# EasyEDA schematic ControlMoteur_ESP32.json
TITLE: Sheet_1; REV: 1.0; Date: 2021-05-30; Sheet: 1/1; Company: Your Company
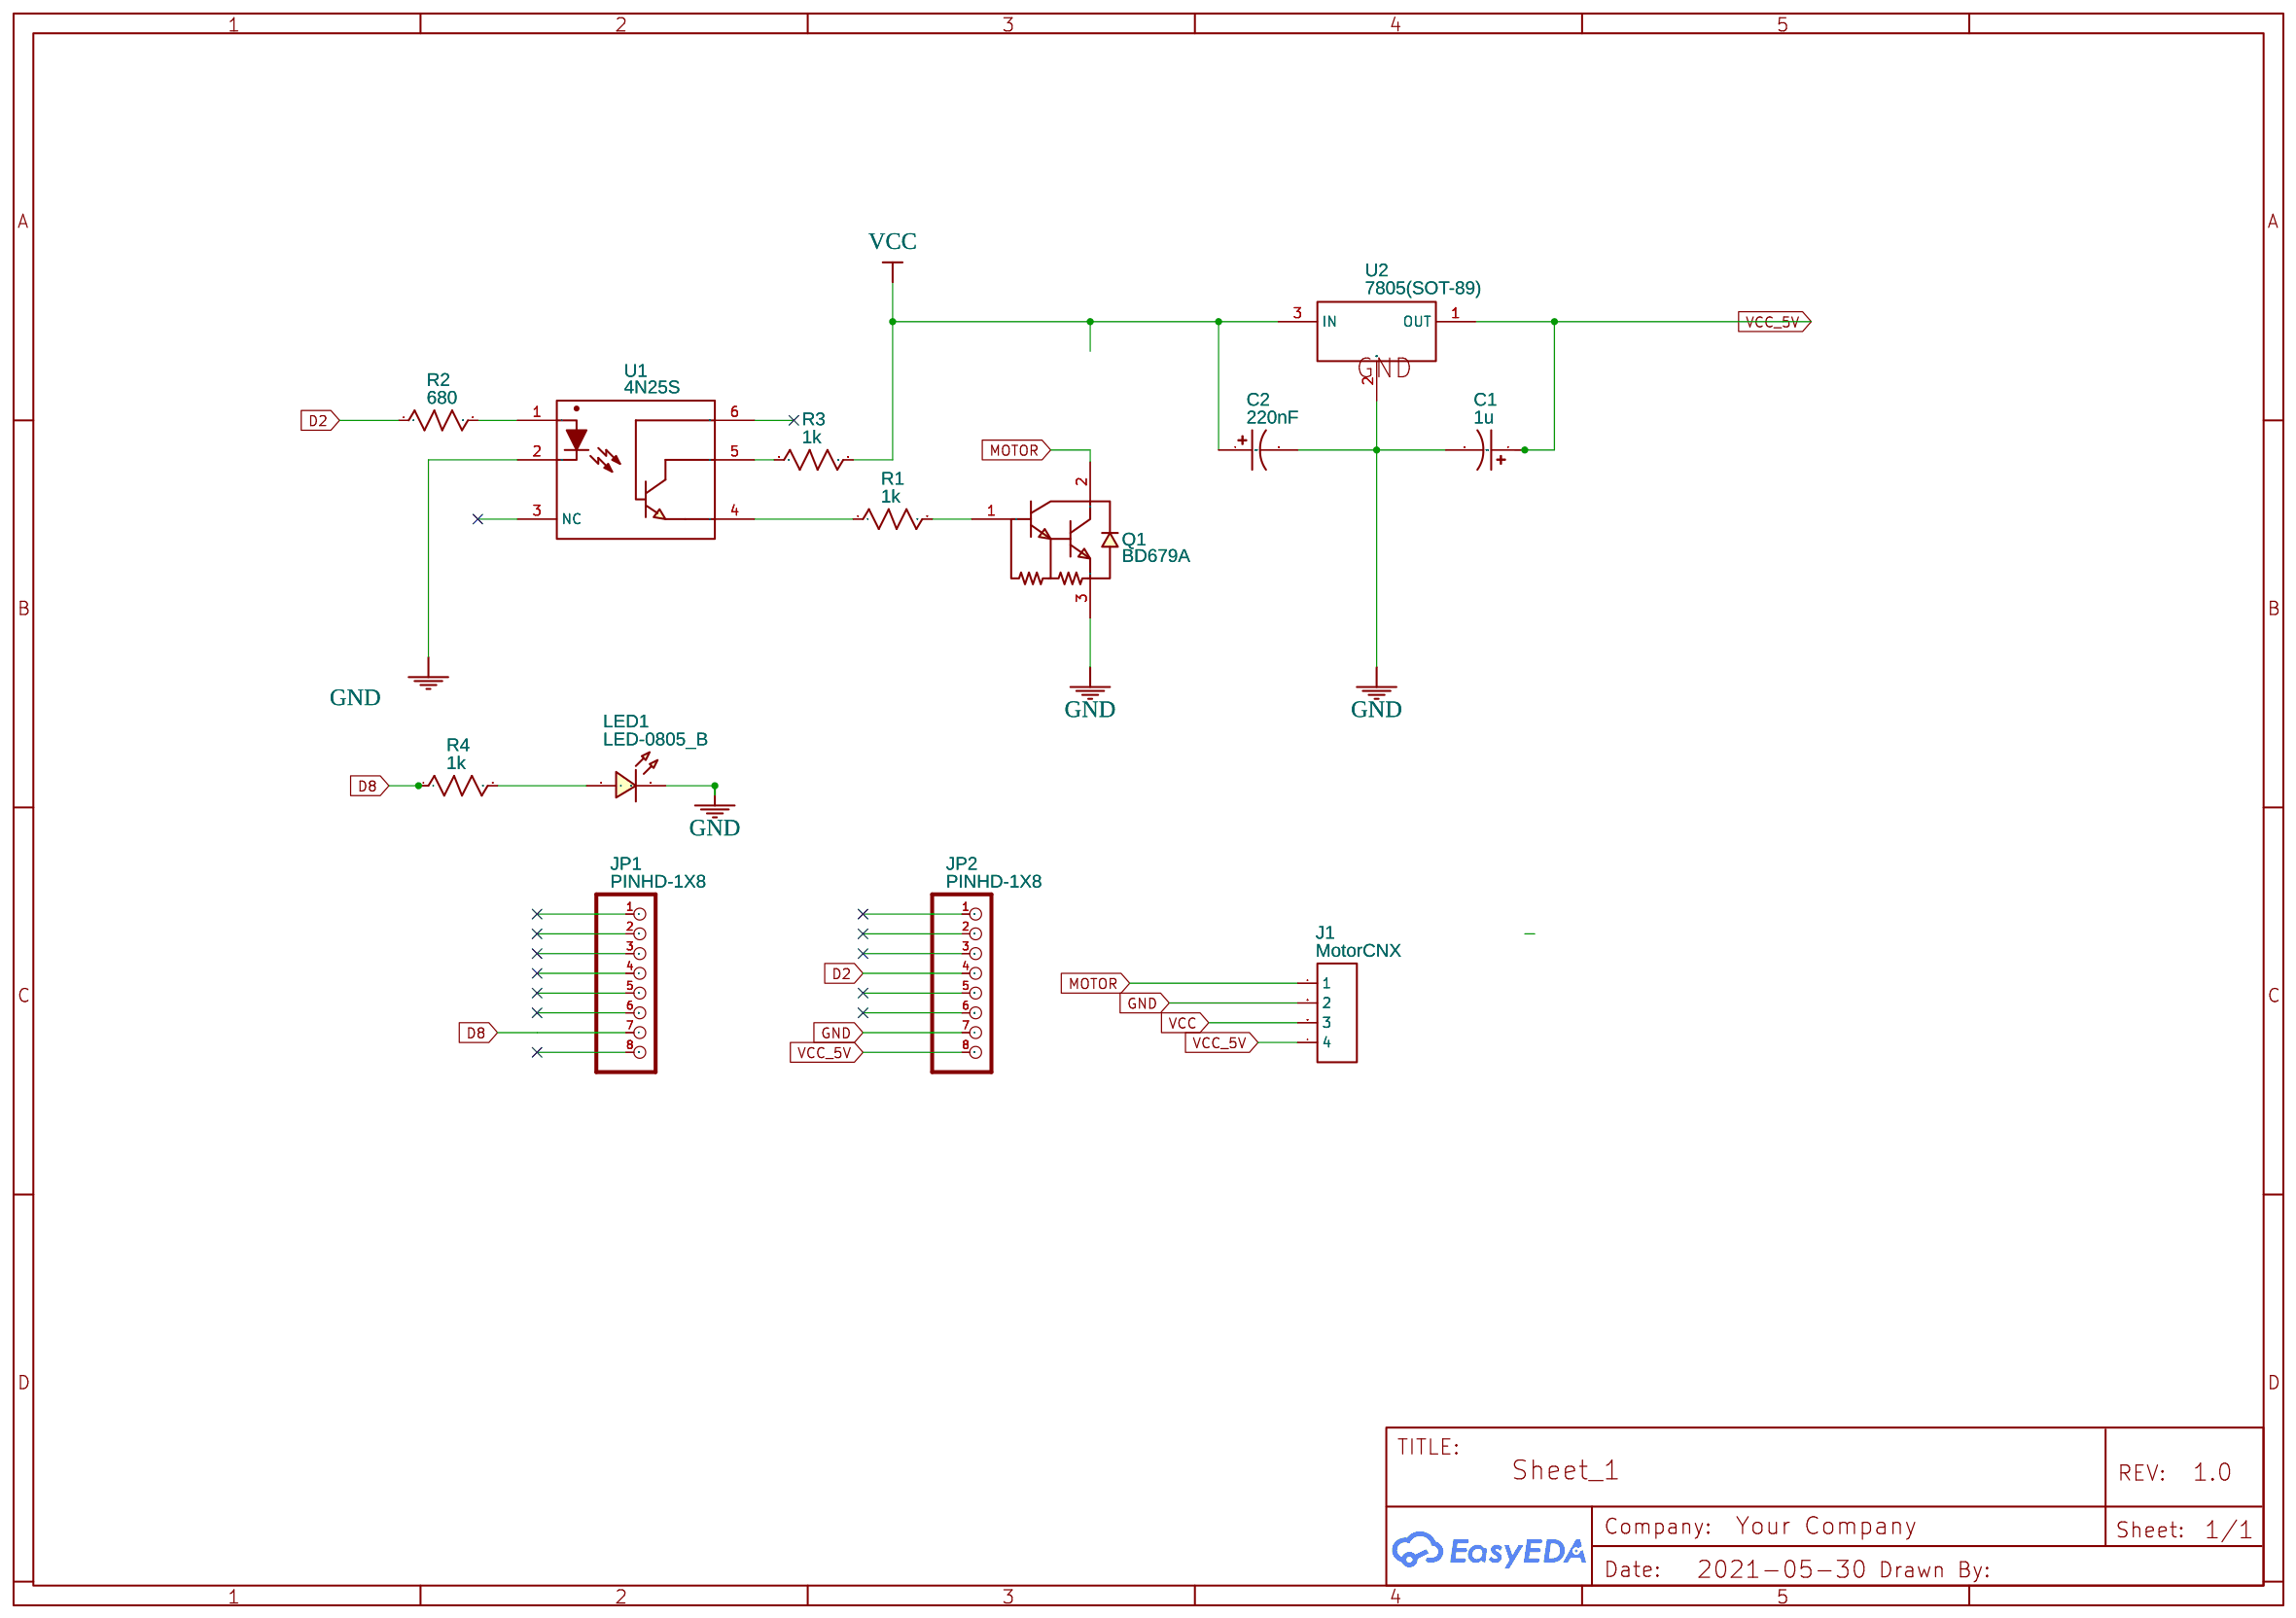
[diagram p0: schematic sheet]

## Parts
C1  1u  [CASE-A_3216]
C2  220nF  [CASE-A_3216]
J1  MotorCNX  [HDR-M-2.54_1X4]
JP1  PINHD-1X8  [1X08-LOCK]
JP2  PINHD-1X8  [1X08-LOCK]
LED1  LED-0805_B  [LED0805_BLUE]
Q1  BD679A  [SOT-32_L7.6-W2.7-P2.29-R]
R1  1k  [R1210]
R2  680  [R1210]
R3  1k  [R1210]
R4  1k  [R1210]
U1  4N25S  [OPTO-SMD-6_L8.5-W6.5-P2.54-LS9.2-BL]
U2  7805(SOT-89)  [SOT-89-3_L4.5-W2.5-P1.50-LS4.2-BR]

## Library data of the parts
C1 C2 = C_Tan_SMD_A_US: Contributor: LCEDA_Lib
J1 = HDR-M-2.54_1x4: Supplier Part: C124378; Supplier: LCSC; Contributor: LCEDA_Lib
JP1 JP2 = PINHD-1X8: Contributor: Adafruit; Package Display: No; Supplier Part: C492407
LED1 = LED-0805_B: Manufacturer: 方舟 ARKLED; Manufacturer Part: D-B080508B1-KS2; Supplier Part: C108412; Contributor: LCEDA_Lib
Q1 = BD679A: Supplier: LCSC; Supplier Part: C2760771; Manufacturer: ST(意法半导体); Contributor: LCSC; JLCPCB Part Class: Extended Part
R1-R4 = R_1210_US: Contributor: LCEDA_Lib
U1 = 4N25S: Supplier: LCSC; Manufacturer: LITEON; Contributor: LCSC; Supplier Part: C143074; JLCPCB Part Class: Extended Part
U2 = 7805(SOT-89): Supplier: LCSC; Manufacturer: CJ; Manufacturer Part: CJ78L05; image: //image.lceda.cn/szlcsc/C2079.jpg; Supplier Part: C2079; Paste Type: expand; Contributor: LCEDA_Lib

## Nets
GND: C1.2 C2.2 J1.2 JP2.7 LED1.2 Q1.3(E) U1.2(CAT) U2.2(GND)
VCC: C2.1 J1.3 R3.2 U2.3(IN)
VCC_5V: C1.1 J1.4 JP2.8 U2.1(OUT)
D2: JP2.4 R2.1
D8: JP1.7 R4.1
MOTOR: J1.1 Q1.2(C)
Net-(LED1-1): LED1.1 R4.2
Net-(Q1-1): Q1.1(B) R1.2
Net-(R1-1): R1.1 U1.4
Net-(R2-2): R2.2 U1.1
Net-(R3-1): R3.1 U1.5(GND)

Not connected (* = marked no-connect by the designer): JP1 1 2 3 4 5 6 8; JP2 1 2 3 5 6; U1 3(NC) 6(VO)
